# Altium schematic sheet Analog_Sense.SchDoc
size A3
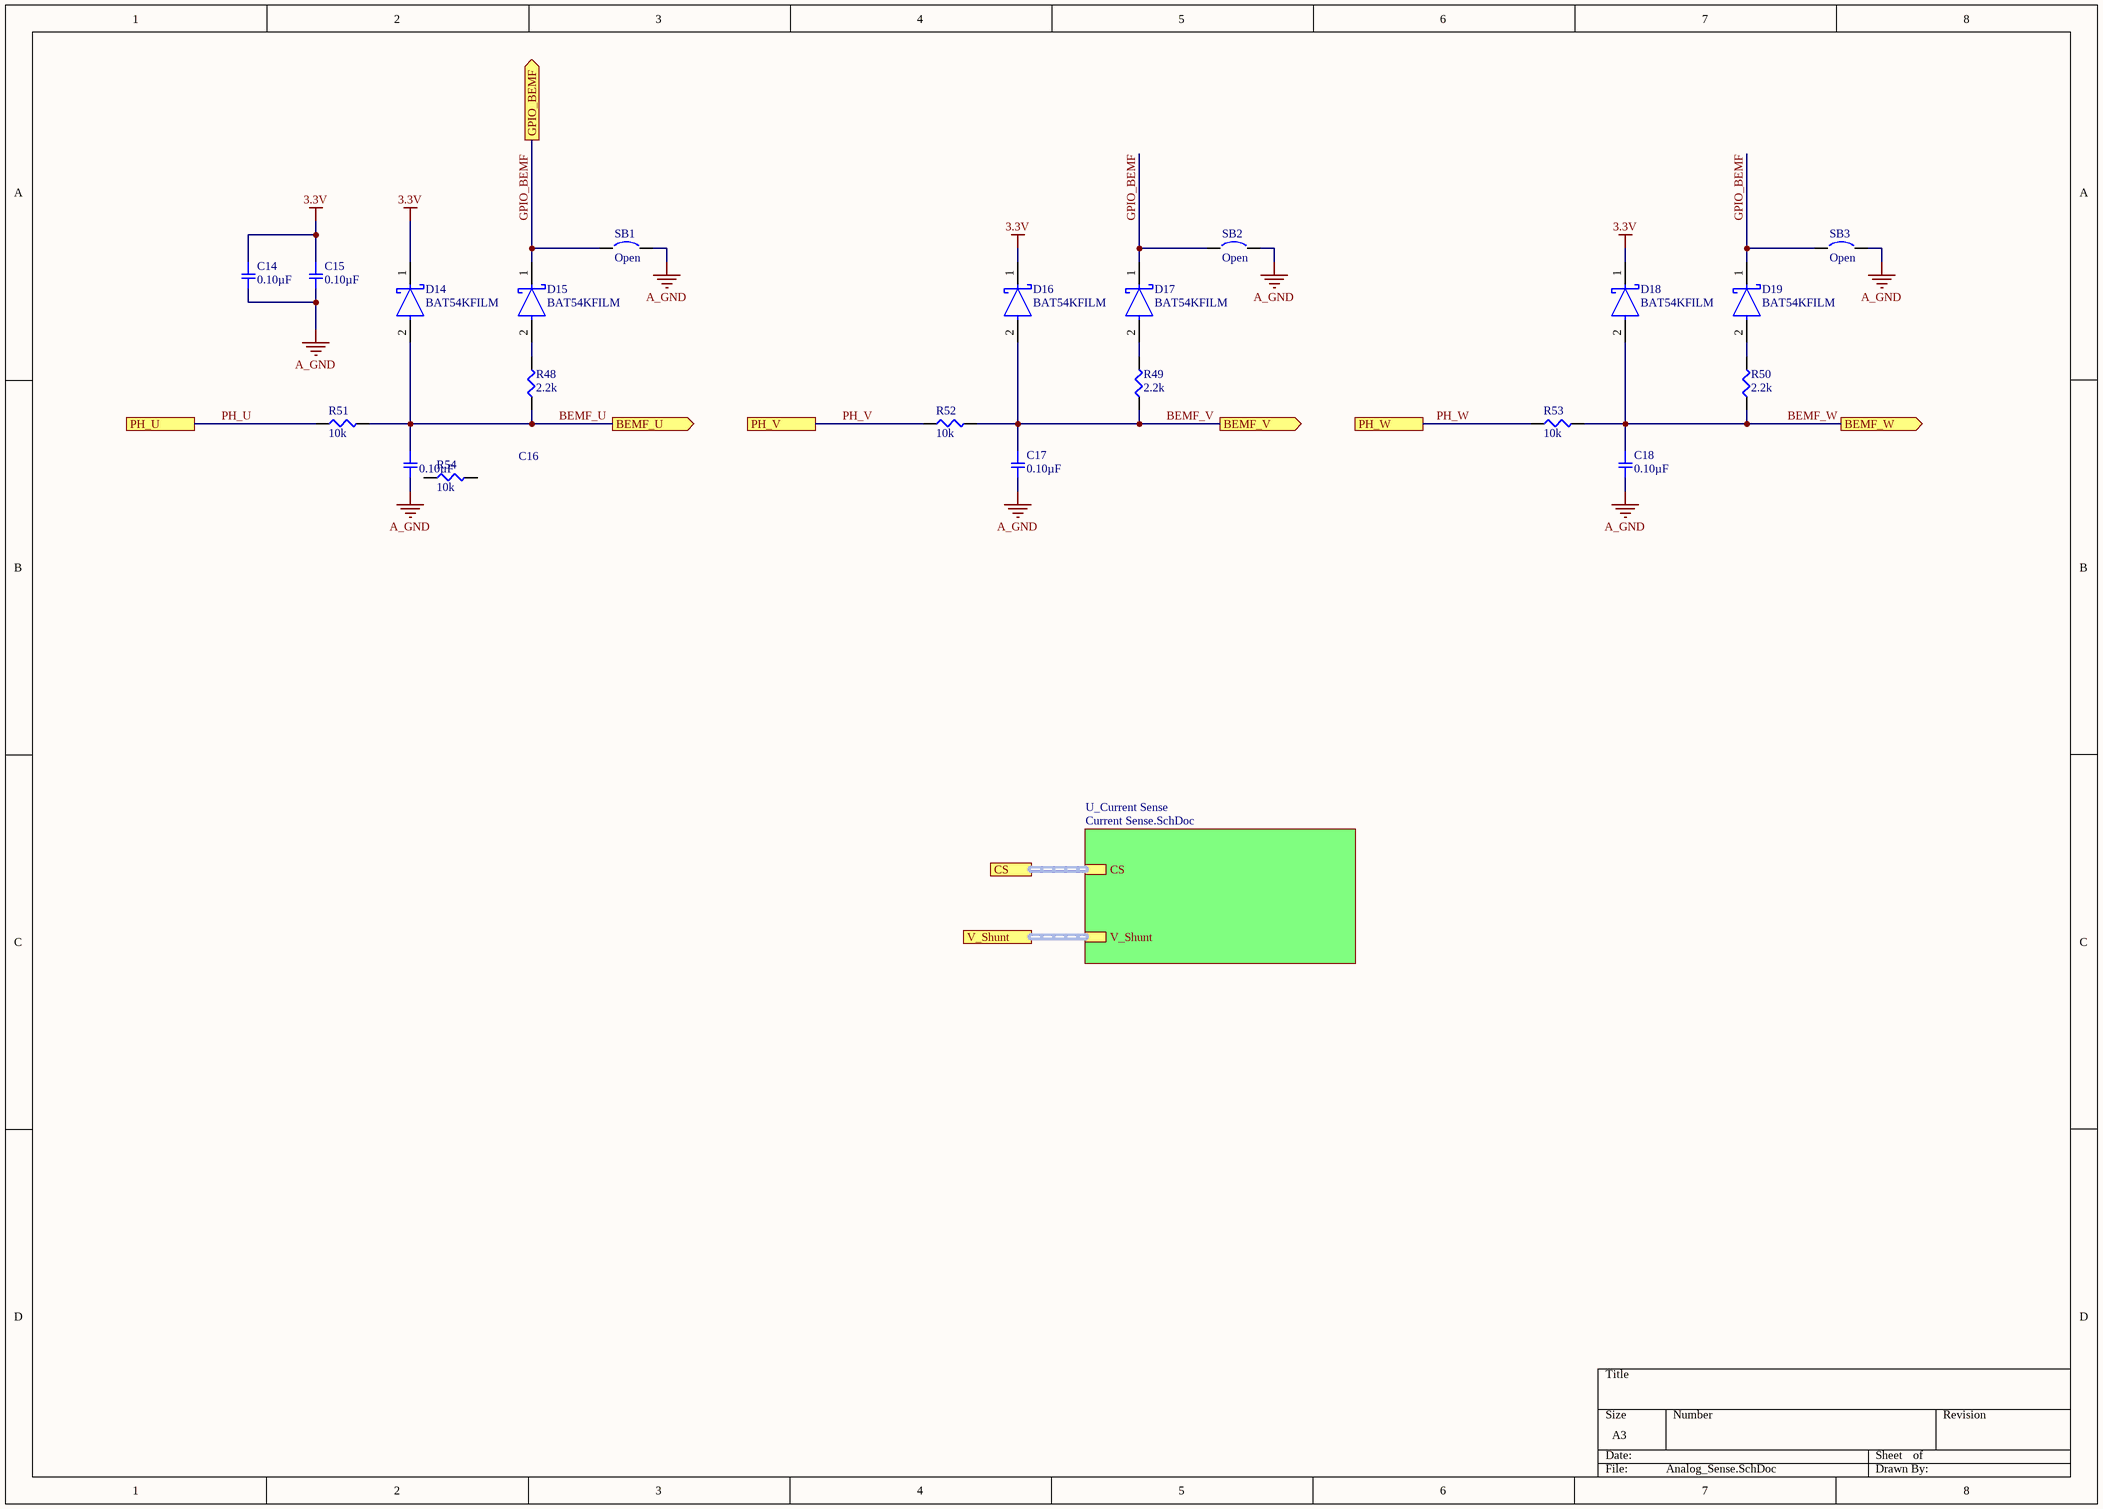
[diagram p0: Analog_Sense.SchDoc]

## Parts
C14  0.10µF  [SMD-0805C]
C15  0.10µF  [SMD-0805C]
C16  0.10µF  [SMD-0805C]
C17  0.10µF  [SMD-0805C]
C18  0.10µF  [SMD-0805C]
D14  BAT54KFILM  [FP-SOD-523-MFG]
D15  BAT54KFILM  [FP-SOD-523-MFG]
D16  BAT54KFILM  [FP-SOD-523-MFG]
D17  BAT54KFILM  [FP-SOD-523-MFG]
D18  BAT54KFILM  [FP-SOD-523-MFG]
D19  BAT54KFILM  [FP-SOD-523-MFG]
R48  2.2k  [SMD-1206-RES]
R49  2.2k  [SMD-1206-RES]
R50  2.2k  [SMD-1206-RES]
R51  10k  [SMD-0805-RES]
R52  10k  [SMD-0805-RES]
R53  10k  [SMD-0805-RES]
R54  10k  [SMD-0805-RES]
SB1  Open  [SB_0603]  (no BOM)
SB2  Open  [SB_0603]  (no BOM)
SB3  Open  [SB_0603]  (no BOM)

## Sub-sheets
U_Current Sense = Current Sense.SchDoc: CS (harness CS), V_Shunt (harness V_Shunt)

## Ports
BEMF_U (out), BEMF_V (out), BEMF_W (out), CS (harness CS), GPIO_BEMF (out), PH_U, PH_V, PH_W, V_Shunt (harness V_Shunt)

## Nets
3.3V: C14.1 C15.1 D14.1(C) D16.1(C) D18.1(C)
A_GND: C14.2 C15.2 C16.2 C17.2 C18.2 SB1.2 SB2.2 SB3.2
BEMF_U: C16.1 D14.2(A) R48.1 R51.2 ; port BEMF_U
BEMF_V: C17.1 D16.2(A) R49.1 R52.2 ; port BEMF_V
BEMF_W: C18.1 D18.2(A) R50.1 R53.2 ; port BEMF_W
GPIO_BEMF: D15.1(C) D17.1(C) D19.1(C) SB1.1 SB2.1 SB3.1 ; port GPIO_BEMF
PH_U: R51.1 ; port PH_U
PH_V: R52.1 ; port PH_V
PH_W: R53.1 ; port PH_W
NetD15_2: D15.2(A) R48.2
NetD17_2: D17.2(A) R49.2
NetD19_2: D19.2(A) R50.2

Not connected (* = marked no-connect by the designer): R54 1 2

## Buses and harness runs
harness port CS = sheet U_Current Sense/CS
harness port V_Shunt = sheet U_Current Sense/V_Shunt

## Library data of the parts
C14-C18 = GCD21BR71H104KA01L: CAP CER 0.1UF 50V X7R 0805; Manufacturer: Murata Electronics North America; Factory Stock: 0; Unit Price (USD): 0.24; Minimum Quantity: 1; Tolerance: ±10%; Datasheets: http://www.murata.com/~/media/webrenewal/support/library/catalog/products/capacitor/mlcc/c03e.ashx; Image: //media.digikey.com/Renders/Murata%20Renders/0805%28GxM6%29.jpg; Digi-Key Part Number: 490-11955-1-ND; Part Number: GCD21BR71H104KA01L; Quantity Available: 157; @ qty: 0; Packaging: Cut Tape (CT); Series: GCD; Part Status: Active; Value: 0.10µF; Voltage: 50V; Temperature Coefficient: X7R; Operating Temperature: -55°C ~ 125°C; Features: -; Ratings: AEC-Q200; Applications: Automotive; Mounting Type: Surface Mount, MLCC; Package / Case: 0805 (2012 Metric); Size / Dimension: 0.079" L x 0.049" W (2.00mm x 1.25mm); Height - Seated (Max): -; Thickness (Max): 0.049" (1.25mm); Lead Spacing: -; Lead Style: -
D14-D19 = CMP-12187-000026-1: DIODE SCHOTTKY 40V 300MA SOD523; Manufacturer: STMicroelectronics; Capacitance: 7pF; Value: 7pF; Max Surge Forward Current: 1.25A; Peak Reverse Current: 1uA; Max Junction Temp: +150°C; Device Class L2: Diodes; Temperature Range Low: -40°C; Category: Diode; Manufacturer Part Number: BAT54KFILM; Digikey Description: DIODE SCHOTTKY 40V 300MA SOD523; Device Class L3: Schottky Diodes; Automotive: No; Height: 0.7mm; Octopart: https://octopart.com/bat54kfilm-stmicroelectronics-39618022; ComponentLink2Description: Datasheet; Temperature Range High: +150°C; Device Class L1: Discrete Semiconductors; Max Repetitive Reverse Voltage: 40V; RoHS: TRUE; Temperature: -40°C to +150°C; ComponentLink2URL: https://www.st.com/content/ccc/resource/technical/document/datasheet/07/50/54/f2/0d/ba/4a/79/CD00001322.pdf/files/CD00001322.pdf/jcr:content/translations/en.CD00001322.pdf; Lead Free: Yes; Forward Current: 300mA; Package: SOD-523; Mouser Description: Schottky Diodes & Rectifiers schottky diode
R48-R50 = ERJ-8ENF2201V: RES SMD 2.2K OHM 1% 1/4W 1206; Manufacturer: Panasonic Electronic Components; Factory Stock: 0; Unit Price (USD): 0.00933; @ qty: 1500; Minimum Quantity: 1; Power (Watts): 0.25W, 1/4W; Temperature Coefficient: ±100ppm/°C; Part Number: ERJ-8ENF2201V; Datasheets: http://industrial.panasonic.com/www-cgi/jvcr13pz.cgi?E+PZ+3+AOA0002+ERJ8ENF2201V+7+WW; Image: //media.digikey.com/Renders/Panasonic%20Renders/ERJ-1206%20Pkg.jpg; Digi-Key Part Number: P2.20KFCT-ND; Quantity Available: 220817; Packaging: Cut Tape (CT); Series: ERJ; Part Status: Active; Value: 2.2k; Tolerance: ±1%; Composition: Thick Film; Features: Automotive AEC-Q200; Operating Temperature: -55°C ~ 155°C; Package / Case: 1206 (3216 Metric); Supplier Device Package: 1206; Size / Dimension: 0.126" L x 0.063" W (3.20mm x 1.60mm); Height - Seated (Max): 0.028" (0.70mm); Number of Terminations: 2; Failure Rate: -
R51-R54 = ERJ-6ENF1002V: RES SMD 10K OHM 1% 1/8W 0805; Manufacturer: Panasonic Electronic Components; Factory Stock: 0; Unit Price (USD): 0.00729; @ qty: 1500; Minimum Quantity: 1; Power (Watts): 0.125W, 1/8W; Temperature Coefficient: ±100ppm/°C; Part Number: ERJ-6ENF1002V; Datasheets: http://industrial.panasonic.com/www-cgi/jvcr13pz.cgi?E+PZ+3+AOA0002+ERJ6ENF1002V+7+WW; Image: //media.digikey.com/Renders/Panasonic%20Renders/ERJ-0805%20Pkg.jpg; Digi-Key Part Number: P10.0KCCT-ND; Quantity Available: 3985614; Packaging: Cut Tape (CT); Series: ERJ; Part Status: Active; Value: 10k; Tolerance: ±1%; Composition: Thick Film; Features: Automotive AEC-Q200; Operating Temperature: -55°C ~ 155°C; Package / Case: 0805 (2012 Metric); Supplier Device Package: 0805; Size / Dimension: 0.079" L x 0.049" W (2.00mm x 1.25mm); Height - Seated (Max): 0.028" (0.70mm); Number of Terminations: 2; Failure Rate: -
SB1-SB3 = Solder Bridge: Circuit Breaker; Published: 24-Mar-1999; Revision: July-2002: Re-released for DXP Platform.; Publisher: Altium Limited